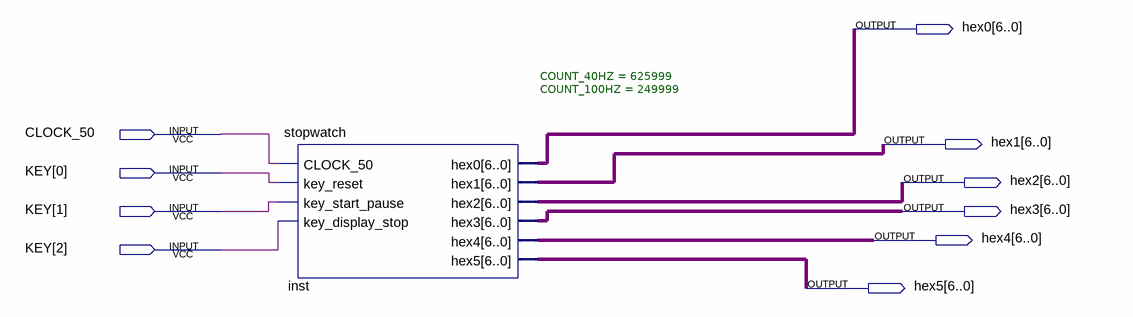
[diagram p0: schematic sheet]
// Quartus schematic naive_clock.bdf as structural Verilog: 1 symbols, 10 pins
module naive_clock (
  input  CLOCK_50,
  input  [2:0] KEY,
  output [6:0] hex0,
  output [6:0] hex1,
  output [6:0] hex2,
  output [6:0] hex3,
  output [6:0] hex4,
  output [6:0] hex5
);

  stopwatch #(.COUNT_40HZ(625999), .COUNT_100HZ(249999)) inst (
    .CLOCK_50(CLOCK_50), .key_reset(KEY[0]), .key_start_pause(KEY[1]), .key_display_stop(KEY[2]),
    .hex0(hex0), .hex1(hex1), .hex2(hex2), .hex3(hex3), .hex4(hex4), .hex5(hex5));
endmodule
